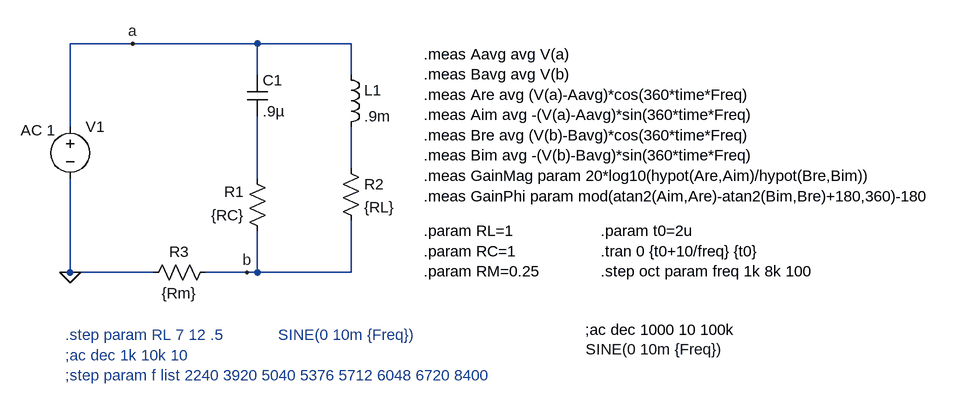
[diagram p0: schematic ortskurve_parallelschwingkreis.asc]
ortskurve_parallelschwingkreis.asc, the LTspice schematic file:
Version 4
SHEET 1 1764 1044
WIRE 64 -80 -32 -80
WIRE 256 -80 64 -80
WIRE 400 -80 256 -80
WIRE 256 -32 256 -80
WIRE 400 -32 400 -80
WIRE -32 48 -32 -80
WIRE 400 112 400 48
WIRE 256 128 256 32
WIRE -32 272 -32 128
WIRE -32 272 -48 272
WIRE 96 272 -32 272
WIRE 240 272 176 272
WIRE 256 272 256 208
WIRE 256 272 240 272
WIRE 400 272 400 192
WIRE 400 272 256 272
FLAG -32 272 0
FLAG 64 -80 a
FLAG 240 272 b
SYMBOL res 272 224 R180
WINDOW 0 36 76 Left 2
WINDOW 3 36 40 Left 2
SYMATTR InstName R1
SYMATTR Value {RC}
SYMBOL cap 240 -32 R0
SYMATTR InstName C1
SYMATTR Value .9µ
SYMBOL voltage -32 32 R0
WINDOW 3 793 358 Left 2
WINDOW 123 -76 21 Left 2
WINDOW 39 -168 151 Left 2
SYMATTR Value SINE(0 10m {Freq})
SYMATTR Value2 AC 1
SYMATTR InstName V1
SYMBOL ind 384 -48 R0
SYMATTR InstName L1
SYMATTR Value .9m
SYMBOL res 384 96 R0
SYMATTR InstName R2
SYMATTR Value {RL}
SYMBOL res 192 256 R90
WINDOW 0 0 56 VBottom 2
WINDOW 3 32 56 VTop 2
SYMATTR InstName R3
SYMATTR Value {Rm}
TEXT 784 208 Left 2 !.param t0=2u\n.tran 0 {t0+10/freq} {t0}\n.step oct param freq 1k 8k 100
TEXT 760 360 Left 2 !;ac dec 1000 10 100k
TEXT 512 208 Left 2 !.param RL=1\n.param RC=1\n.param RM=0.25
TEXT -40 368 Left 2 ;.step param RL 7 12 .5\n;ac dec 1k 10k 10\n;step param f list 2240 3920 5040 5376 5712 6048 6720 8400
TEXT 512 -64 Left 2 !.meas Aavg avg V(a)\n.meas Bavg avg V(b)\n.meas Are avg (V(a)-Aavg)*cos(360*time*Freq)\n.meas Aim avg -(V(a)-Aavg)*sin(360*time*Freq)\n.meas Bre avg (V(b)-Bavg)*cos(360*time*Freq)\n.meas Bim avg -(V(b)-Bavg)*sin(360*time*Freq)\n.meas GainMag param 20*log10(hypot(Are,Aim)/hypot(Bre,Bim))\n.meas GainPhi param mod(atan2(Aim,Are)-atan2(Bim,Bre)+180,360)-180
TEXT 288 368 Left 2 ;SINE(0 10m {Freq})

The netlist it stands for:
* ortskurve_parallelschwingkreis.asc
R1 b N002 {RC}
C1 a N002 .9µ
V1 a 0 SINE(0 10m {Freq}) AC 1
L1 a N001 .9m
R2 N001 b {RL}
R3 b 0 {Rm}
.param t0=2u
.tran 0 {t0+10/freq} {t0}
.step oct param freq 1k 8k 100
;ac dec 1000 10 100k
.param RL=1
.param RC=1
.param RM=0.25
* .step param RL 7 12 .5
* ;ac dec 1k 10k 10
* ;step param f list 2240 3920 5040 5376 5712 6048 6720 8400
.meas Aavg avg V(a)
.meas Bavg avg V(b)
.meas Are avg (V(a)-Aavg)*cos(360*time*Freq)
.meas Aim avg -(V(a)-Aavg)*sin(360*time*Freq)
.meas Bre avg (V(b)-Bavg)*cos(360*time*Freq)
.meas Bim avg -(V(b)-Bavg)*sin(360*time*Freq)
.meas GainMag param 20*log10(hypot(Are,Aim)/hypot(Bre,Bim))
.meas GainPhi param mod(atan2(Aim,Are)-atan2(Bim,Bre)+180,360)-180
* SINE(0 10m {Freq})
.backanno
.end